# EAGLE design Design1 (EAGLE 9.5.1)
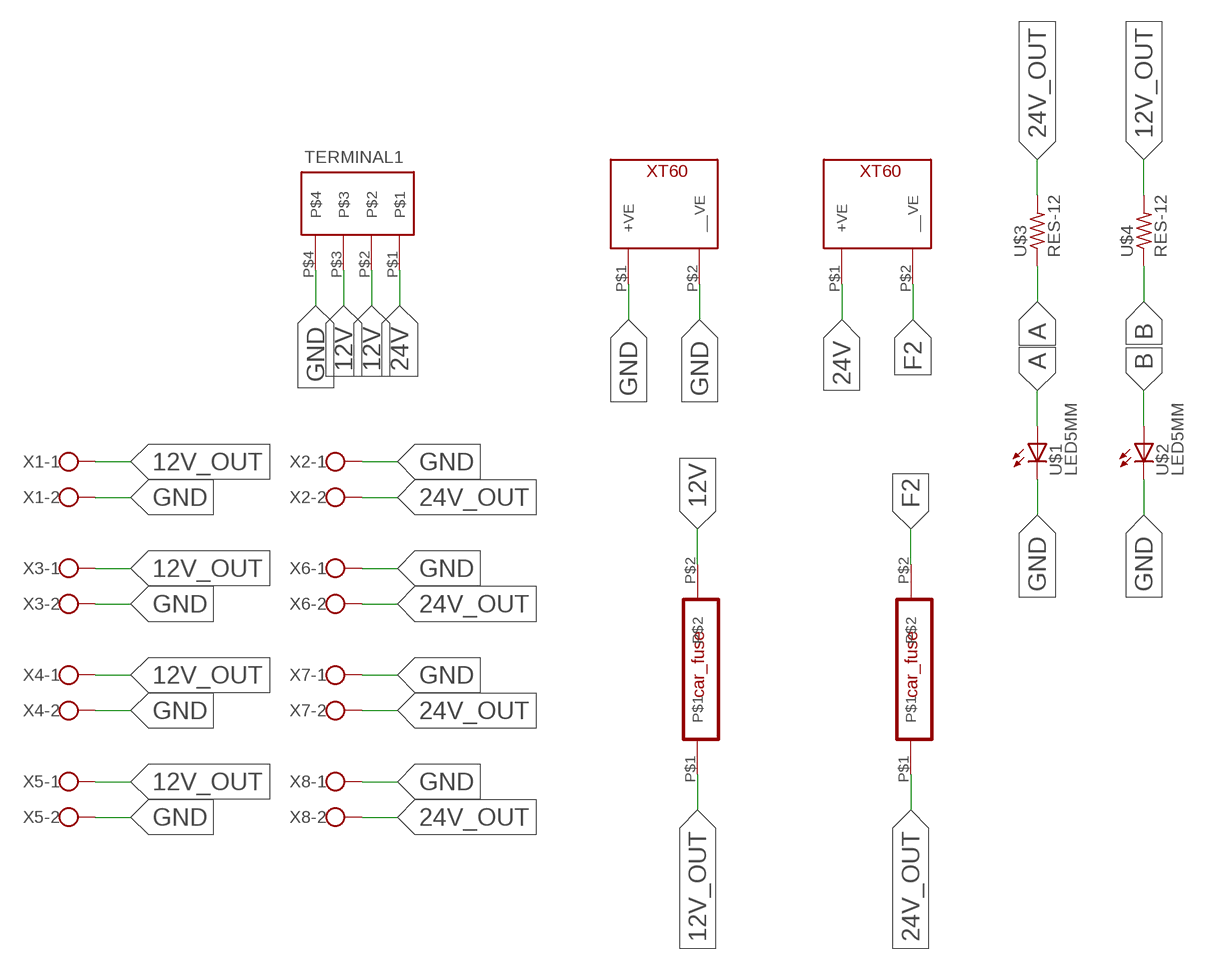
[diagram p0: schematic, sheet 1]

## Parts
FUSE_12  CAR_FUSE  [CAR_FUSE]
FUSE_24  CAR_FUSE  [CAR_FUSE]
SWITCH_12  XT60_CONNECTOR  [XT60]
SWITCH_24  XT60_CONNECTOR  [XT60]
TERMINAL1  BARRIER_TERMINAL_BLOCK_4PIN_9.5MM  [BARRIER_TERMINAL_BLOCK_4PIN_9.5MM]
U$1  LED5MM  [LED5MM]
U$2  LED5MM  [LED5MM]
U$3  RES-12  [0207/12]
U$4  RES-12  [0207/12]
X1  ROSTA.POWER  [W239-302]
X2  ROSTA.POWER  [W239-302]
X3  ROSTA.POWER  [W239-302]
X4  ROSTA.POWER  [W239-302]
X5  ROSTA.POWER  [W239-302]
X6  ROSTA.POWER  [W239-302]
X7  ROSTA.POWER  [W239-302]
X8  ROSTA.POWER  [W239-302]

## Nets
12V: FUSE_12.P$2 TERMINAL1.P$2 TERMINAL1.P$3
12V_OUT: FUSE_12.P$1 U$4.2 X1.1 X3.1 X4.1 X5.1
24V: SWITCH_24.P$1(+VE) TERMINAL1.P$1
24V_OUT: FUSE_24.P$1 U$3.2 X2.2 X6.2 X7.2 X8.2
A: U$1.A U$3.1
B: U$2.A U$4.1
F2: FUSE_24.P$2 SWITCH_24.P$2(__VE)
GND: SWITCH_12.P$1(+VE) SWITCH_12.P$2(__VE) TERMINAL1.P$4 U$1.K(C) U$2.K(C) X1.2 X2.1 X3.2 X4.2 X5.2 X6.1 X7.1 X8.1

## Library data of the parts
FUSE_12 FUSE_24 = MIA_LIBRARY-2-2-2:CAR_FUSE
SWITCH_12 SWITCH_24 = MIA_LIBRARY-2-2-2:XT60_CONNECTOR
TERMINAL1 = terminal_block_4pins:BARRIER_TERMINAL_BLOCK_4PIN_9.5MM
U$1 U$2 = MIA_LIBRARY-2-2-2:LED5MM
U$3 U$4 = MIA_LIBRARY-2-2-2:RES-12
X1-X8 = MIA_LIBRARY-2-2-2:ROSTA.POWER: WAGO SCREW CLAMP; OC_FARNELL: unknown; OC_NEWARK: unknown

## Board
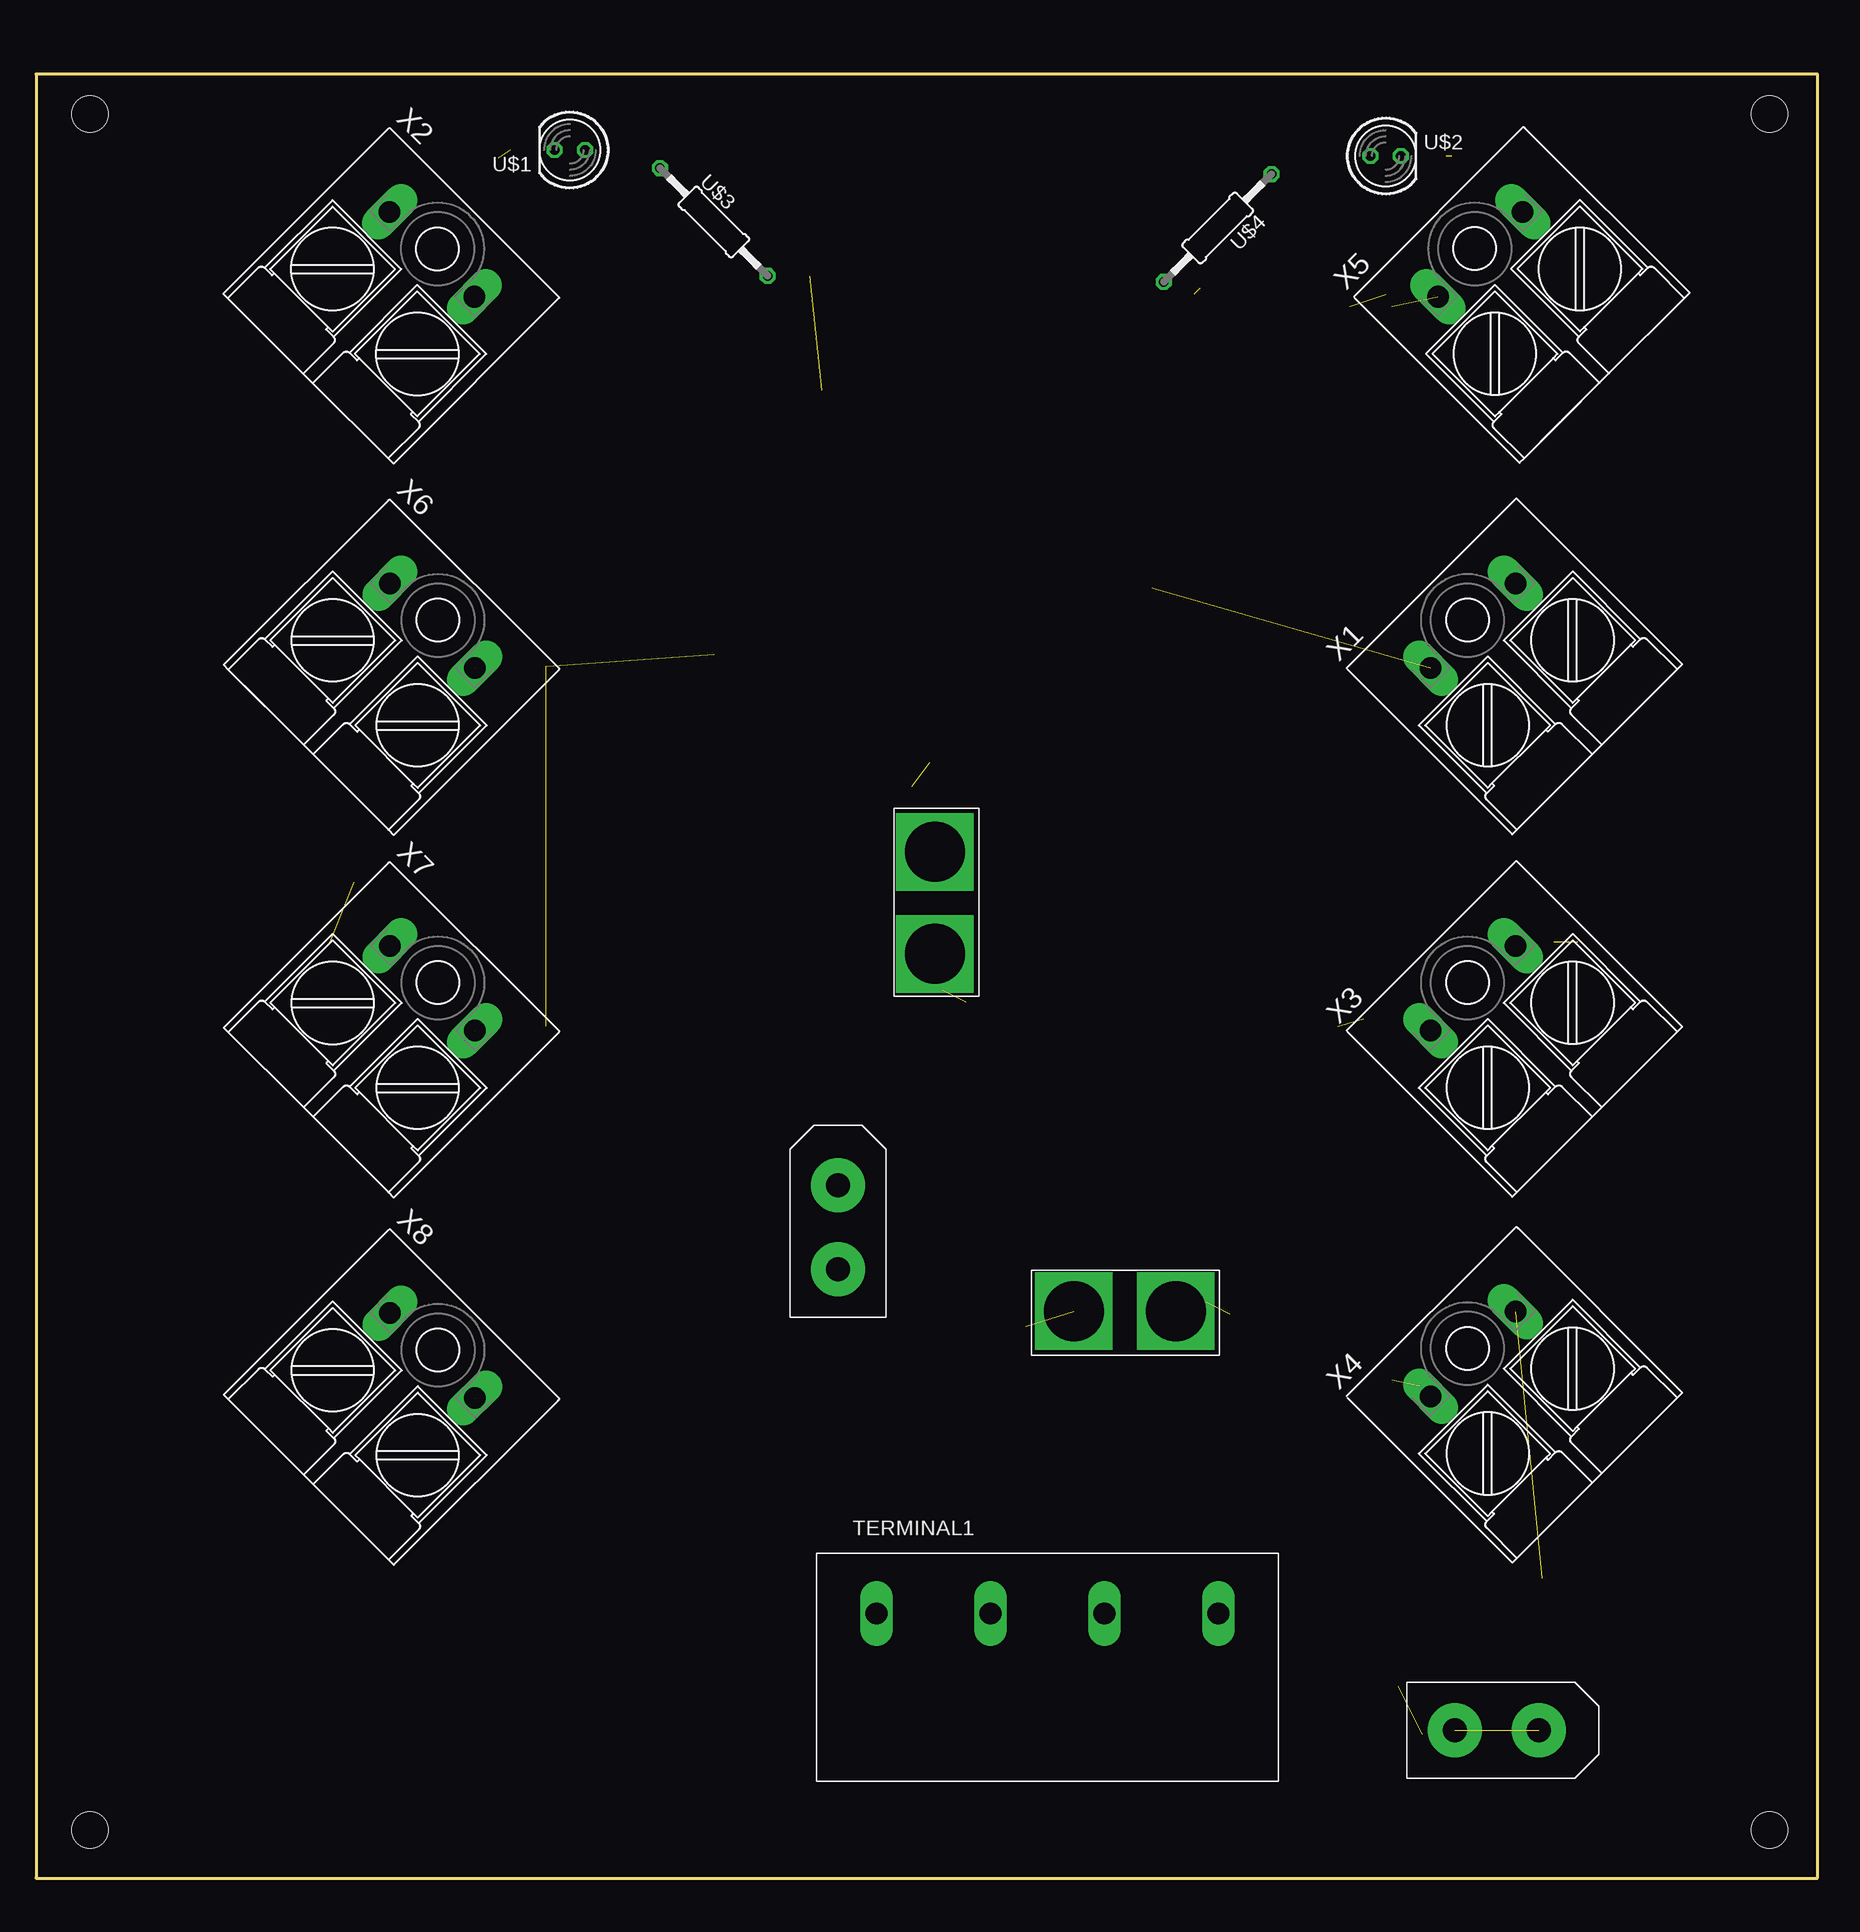
[diagram p1: board, top side]
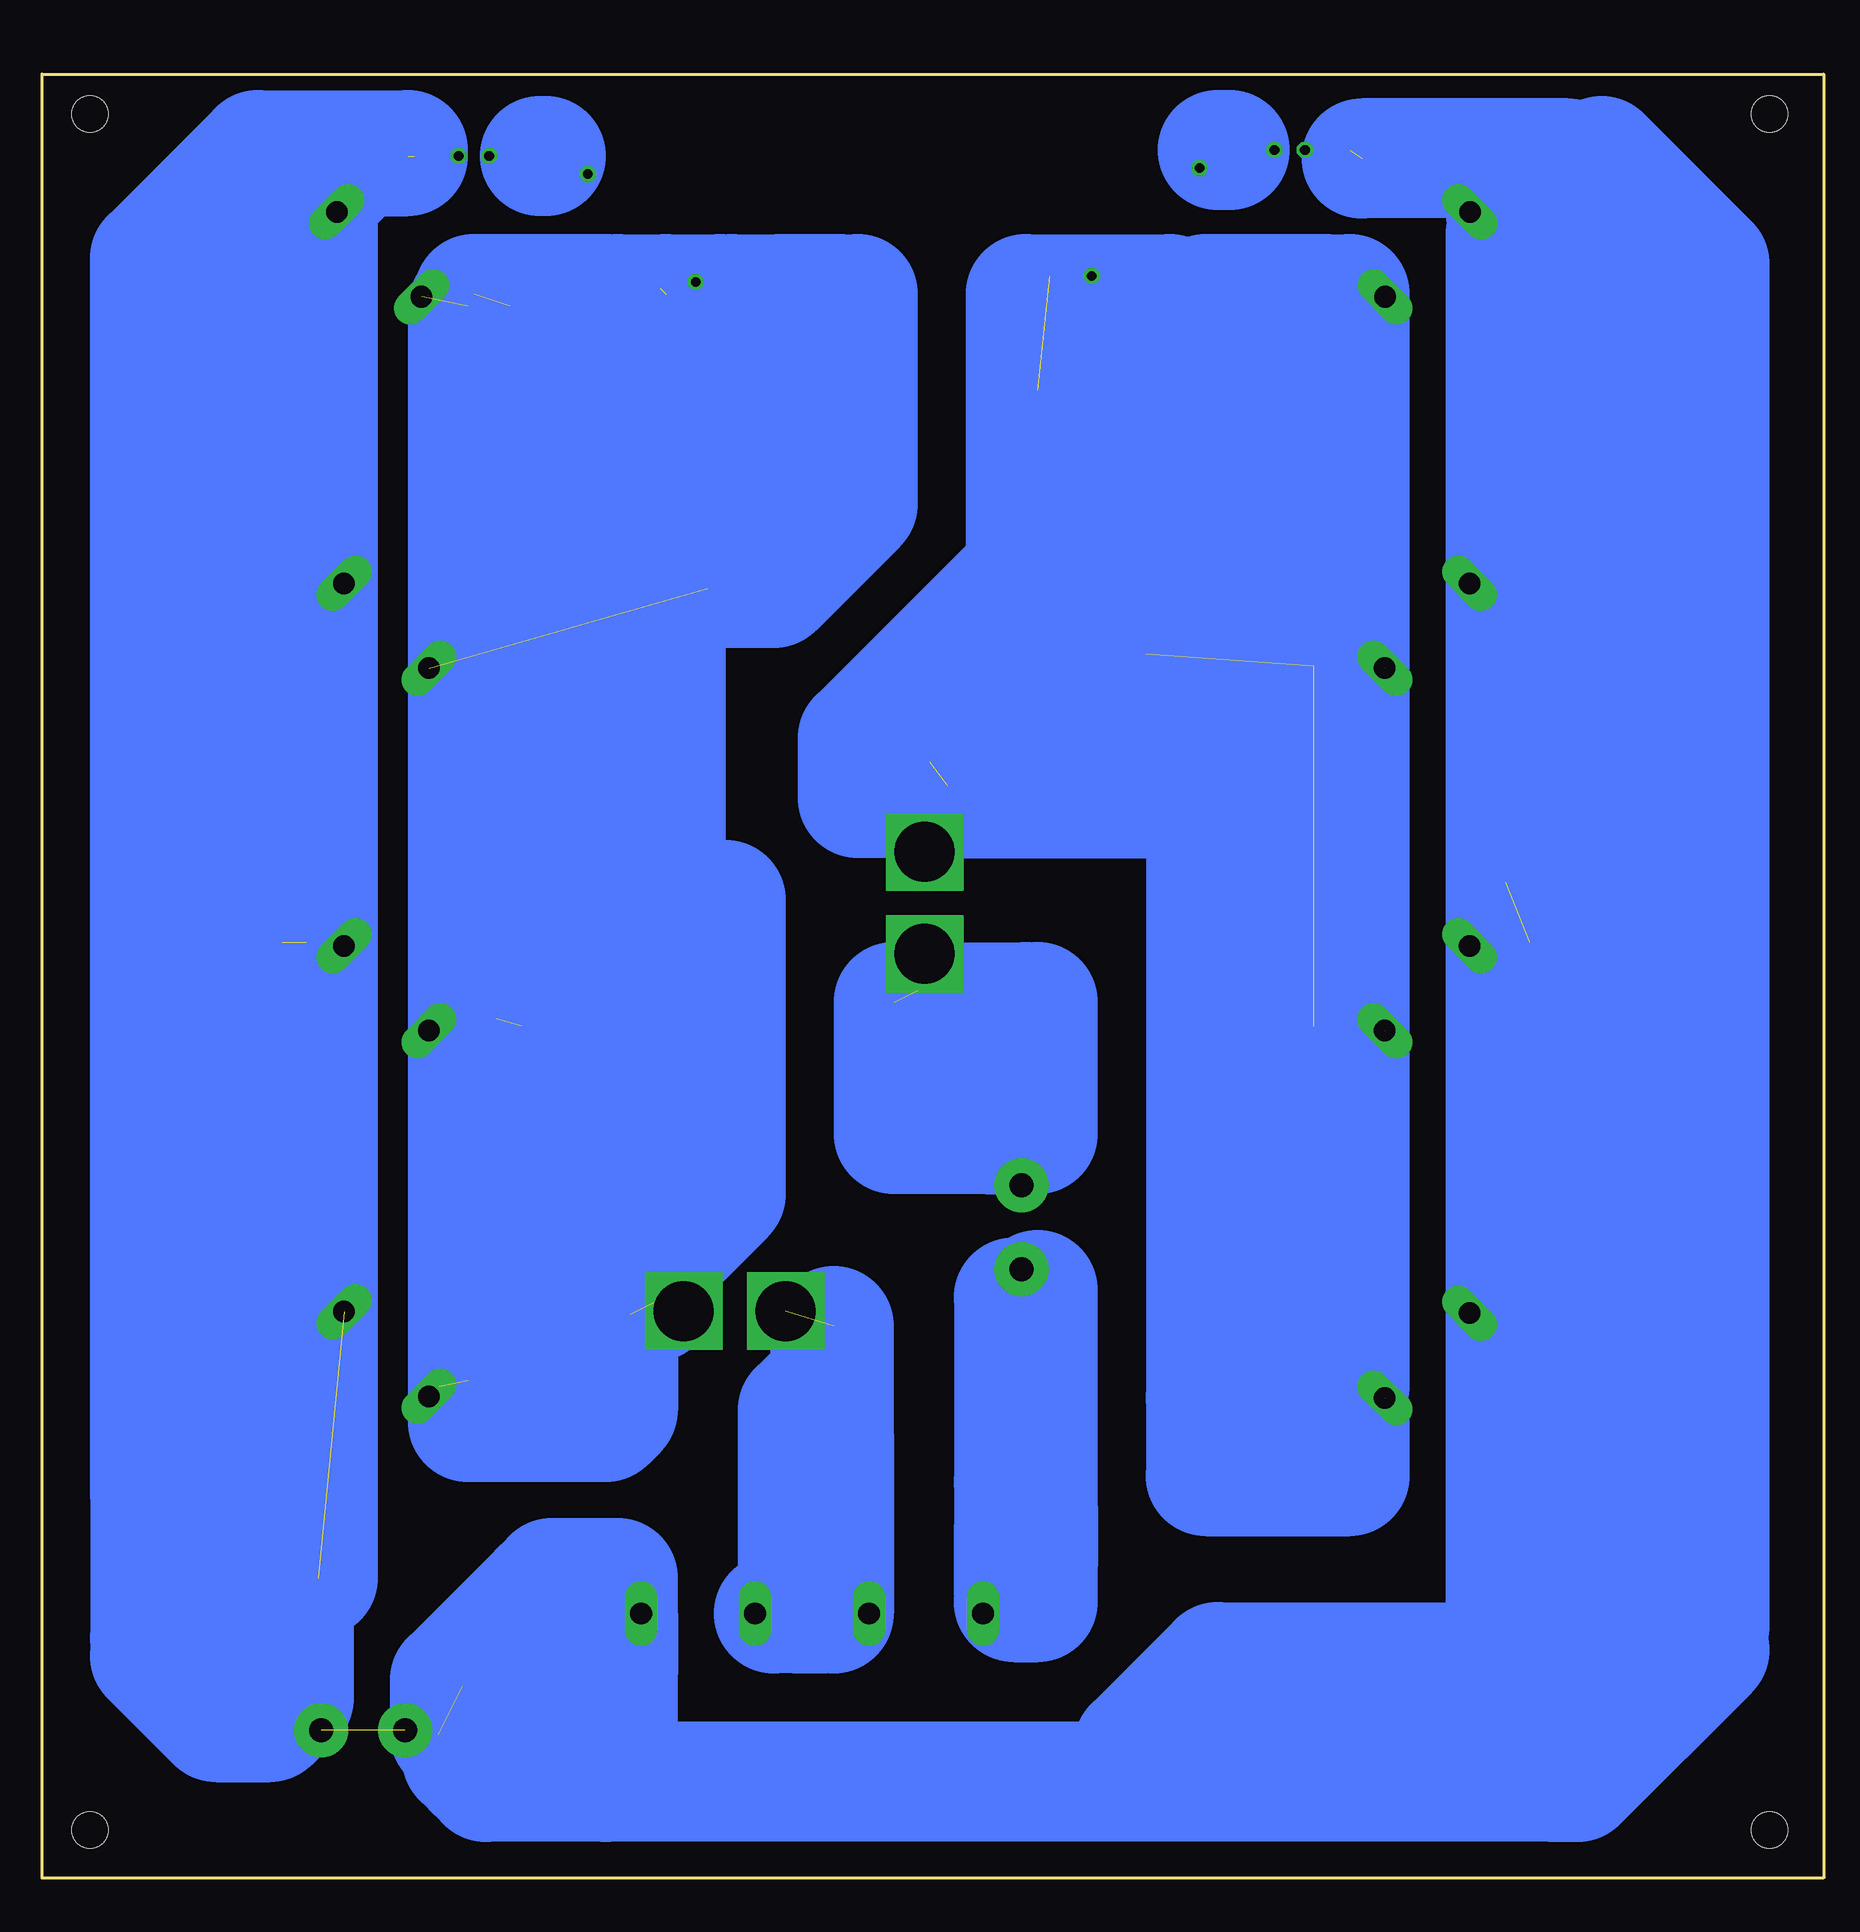
[diagram p2: board, bottom side, seen from below]

Size 148.5 x 150.32 mm. Coordinates in mm from the lower left corner, seen from the top.
Outline: 0,0 148.5,0 148.5,150.32 0,150.32 0,0
Copper layers (1*16): Top 0.035mm / dielectric 1.5mm / Bottom 0.035mm
Design rules "default": minimum track width 6mil, minimum drill 0.35mm, track to track 6mil, track to pad 6mil, pad to pad 6mil, via to via 6mil, smd to smd 6mil, copper to edge 40mil, drill to drill 6mil, minimum pad ring 10mil, minimum via ring 8mil, stop-mask expansion 4mil, vias tented up to drill 0mil, thermal gap 10mil
Holes 3 mm at 4.5,147 144.5,147 144.5,4 4.5,4

### Footprints (pad centres in the part's own frame; a part is rotated, then mirrored left to right if it is on the bottom)
CAR_FUSE = drill 5 pad 6.452 square: P$1 2.794,-0.127; P$2 11.303,-0.127
XT60 = drill 2 pad 4.5: P$1 -4,-4; P$2 -11,-4
BARRIER_TERMINAL_BLOCK_4PIN_9.5MM = drill 1.8 long: P$1 0,0; P$2 9.5,0; P$3 19,0; P$4 28.5,0
LED5MM = drill 0.813 octagon: A -1.27,0; K 1.27,0
0207/12 = drill 0.813 octagon: 1 -6.35,0; 2 6.35,0
W239-302 = drill 1.8 long: 1 -5,5; 2 5,5

### Placement (x,y rotation side)
FUSE_12  97.81,47.12 180 top
FUSE_24  75.06,88.31 270 top
SWITCH_12  114.25,8.31 180 top
SWITCH_24  70.87,46.75 270 top
TERMINAL1  70.06,22.05 0 top
U$1  44.5,144 180 top
U$2  112.5,143.5 0 top
U$3  56.5,138 315 top
U$4  98.5,137.5 225 top
X1  123.32,100.82 45 top
X2  29.47,131.77 315 top
X3  123.32,70.61 45 top
X4  123.32,40.13 45 top
X5  123.93,131.77 45 top
X6  29.5,100.82 315 top
X7  29.5,70.61 315 top
X8  29.5,40 315 top

### Tracks (layer width: path | path; a pad name or v marks a point on that pad's centre or on a via)
12V  (1 unrouted)
  Bottom 10: 85.5,22.05 83.5,22.05 | 85.5,22.05 85.5,37 | 85.5,37 82.5,37 | 82.5,37 82.5,22.05 | 82.5,37 82.5,46 | 85.5,37 85.5,39 83.5,41 | 85.5,22.05 87.5,22.05
  Bottom 2.54: TERMINAL1.P$2 82.5,22.05 83.5,22.05 | 87.5,22.05 TERMINAL1.P$3 | FUSE_12.P$2 86.51,36.01 86.5,36
12V_OUT  (7 unrouted)
  Bottom 0.152: U$4.2 95.99,133.01 96.5,132.5 97,132.5
  Bottom 10: 110.27,72 110.27,131.77 110.2,131.84 102.3,131.84 102.13,132 100.5,132 | 110.27,72 110.27,43.23 | 112.5,41 110.27,43.23 | 110.27,72 110.66,71.61 | 110.27,43.23 110.27,39.23 110.5,39 | 100.5,48 100.5,130.54 101.73,131.77 101.5,132 | 100.5,48 100.5,39 101.5,38 113,38 113,131 | 110.5,39 109.5,38 | 100.5,48 97.5,48 | 112.5,41 113,41.5 | 112.5,41 110.5,39 | 112.5,41 112.5,38 | 100.5,48 96.5,52 | 96.5,132 96.5,108 | 96.5,52 96.5,108 | 96.5,52 91.5,57 91.5,81.5 | 96.5,108 91,108 | 91,108 90.5,107.5 | 91,132 91,114 | 91,114 91,108 | 87,132 87,108 | 87,108 87.5,107.5 93,107.5 | 101.5,132 92,132 87,132 | 91,114 85,120 85,132 | 91,108 87,108 | 87,108 82,113 | 82,113 82,132 87,132 | 82,113 80.5,114.5 80.5,132 | 101.5,132 112.5,132
  Bottom 2.54: X4.1 115.38,41 | X3.1 114.5,70.61 113.5,71.61 109.11,71.61 108.5,71 | 110.27,131.77 109.5,131 | FUSE_12.P$1 99.25,47.25 99.5,47
24V
  Bottom 10: 65.5,31 65.5,26.61 65.5,26 67.5,24 67.5,29 65.5,31 | 65.5,31 67.5,33 | 67.5,48.38 67.5,33 | 67.5,33 67.5,23 65.5,23 65.5,49
  Bottom 2.54: TERMINAL1.P$1 65.5,26.61 65.5,27 | SWITCH_24.P$1 67.5,51.38 67.5,48.38 67.5,48
24V_OUT  (7 unrouted)
  Bottom 0.152: U$3.2 64.49,133.51 64.5,133.5
  Bottom 10: 42.5,40 42.5,132 39.5,132 39.5,41 40.5,40 | 41.5,132 51.5,132 51.5,100 | 51.5,100 51.5,40 | 42.5,40 51.5,40 | 42.5,101 39.5,101 | 42.5,71 39.5,71 | 42.5,40 40.5,40 | 74.93,90 62.93,102 56.5,102 | 58.5,110 65.5,110 | 74.93,90 80.5,90 80.5,95 65.5,110 | 65.5,110 66.5,111 66.5,132 54.5,132 54.5,115 58.5,111 61.5,111 61.5,122 | 61.5,122 62.5,122 | 61.5,122 61.5,125.5 59.5,127.5 59.75,127.75 61.75,127.75 65.5,124 | 51.5,40 51.5,33.5 39.5,33.5 39.5,39 40.5,40 | 51.5,100 60.5,91 73,91 | 74.93,90 53.5,90 53.5,114.5
  Bottom 2.54: X2.2 36.77,132 39.5,132 41.5,132 42.5,132 | X6.2 36.75,101 39.5,101 | X7.2 36.96,71 39.5,71 | 40.5,40 X8.2 | FUSE_24.P$1 74.93,90 74.93,92.57 74.5,93
A
  Bottom 0.152: U$3.1 50.5,144 | 50.5,144 | 50.5,144 49.5,144 U$1.A
  Bottom 10: 50.5,144 | 49.5,144 50.5,144
B
  Bottom 0.152: U$2.A 107,143.49 | 106.5,143.49 104.49,143.49 U$4.1
  Bottom 10: 106.5,143.49 107,143.49
F2  (1 unrouted)
  Bottom 10: 74.5,68.26 69.87,63.63 69.87,62 | 74.5,68.26 74.5,73 66.5,73 66.5,62.37 | 69.87,62 66.87,62 66.5,62.37 | 69.87,62 74.5,62 | 74.5,62 74.5,68.26 | 74.5,62 77.5,62 77.5,73 | 69.87,62 69.5,62.37 69.5,72 | 66.5,62.37 66.13,62 65.5,62 65.5,73
  Bottom 2.54: FUSE_24.P$2 74.93,74.57 75.5,74 | 66.87,62 SWITCH_24.P$2 | 69.87,63.63 69.5,64
GND  (7 unrouted)
  Bottom 0.152: U$1.K 39.5,144 | 117.5,143.5 U$2.K | 122,143.5 122,132.5
  Bottom 10: 131.5,32 139.5,32 | 139.5,32 139.5,20 | 22.48,8.02 9.5,21 9.5,124 | 24.66,138.84 19.5,133.68 19.5,78 | 18.5,20 19.5,21 | 19.5,78 19.5,21 | 9.5,124 18.5,133 | 26.5,47.07 24.57,47.07 | 19.5,78 26.5,78 26.5,83 | 23.61,107.89 26.5,107.89 | 24.66,138.84 26.5,138.84 25.5,137.84 25.5,115 | 131.5,32 131.5,78 | 131.5,78 131.5,108 | 131.5,108 131.5,123 | 131.5,123 131.5,136 | 131.5,136 127.5,140 125.5,140 | 139.5,32 139.5,127 | 139.5,127 132.5,134 | 139.5,127 139.5,128 | 139.5,128 131.5,136 | 129.3,47.2 126.5,47.2 | 131.5,78 126.5,78 | 131.5,108 131.39,107.89 126.5,107.89 | 19.5,21 23.5,17 | 29.5,11 23.5,17 | 23.5,17 24.5,18 | 57.5,11 50.5,18 24.5,18 | 102.45,22.05 104.45,22.05 111.5,15 111.5,9 | 101.5,8.02 111.5,8.02 | 22.48,8.02 101.5,8.02 | 101.5,8.02 100.5,9.02 100.5,17 | 100.5,17 105.5,17 105.5,13 | 100.5,17 100.5,22.05 100.5,24 | 112.5,9.02 111.5,8.02 | 112.5,9.02 112.5,17 107.5,22 106.5,22 | 111.5,8.02 111.5,9 | 111.5,9 114.5,12 114.5,16.5 107,24 | 132.5,13 139.5,20 | 132.5,13 129.5,13 127.5,15 127.5,124 | 131.5,14 131.5,32 | 112.5,9.02 113.5,10.02 113.5,16 | 26.5,47.07 26.5,107.89 | 131.5,123 127.5,127 127.5,139 | 125.5,25 125.5,140 | 24.66,138.84 29.12,143.3 | 29.12,143.3 38.5,143.3 | 125.5,140 122,143.5 | 125.5,140 125.5,141.5 123.5,143.5 | 123.5,143.5 118,143.5 | 24.5,18 26.5,20 26.5,47.07 | 100.5,24 107,24 | 100.5,24 100.5,25 106,25 107,24 | 26.5,107.89 26.5,137 24.66,138.84 | 139.5,128 139.5,130 | 139.5,130 126,143.5 123.5,143.5 | 139.5,130 139.5,131.5 | 139.5,131.5 127.5,143.5 | 139.5,131.5 139.5,135 130.5,144 118,144 | 9.5,124 9.5,127 | 9.5,127 24.5,142 | 9.5,127 9.5,131.5 | 9.5,131.5 21.3,143.3 29.12,143.3 | 9.5,131.5 9.5,134.5 18.5,143.5 | 22.48,8.02 20.48,8.02 9.5,19
  Bottom 10: 139.5,20 139.5,18.5 134,13 132.5,13
  Bottom 2.54: 26.5,47 29.43,47 X8.1 26.5,47.07 | X7.1 24.82,77.68 24.5,78 | 26.5,107.89 X6.1 | 23.5,108 23.61,107.89 | 24.5,47 24.57,47.07 | X2.1 26.5,138.84 | 24.66,138.84 24.5,139 | 126.5,47.2 X4.2 | 129.5,47 129.3,47.2 | 128.5,78 128.18,77.68 X3.2 129.18,77.68 129.5,78 | X1.2 126.5,107.89 128.39,107.89 128.5,108 | X5.2 124.09,139 127.5,139 129.5,139 | 98.5,19 98.56,19.06 TERMINAL1.P$4 100.5,22.05 102.45,22.05 102.5,22 | SWITCH_12.P$1 117.94,12 115.5,12 | SWITCH_12.P$2 126.19,12.31 126.5,12 131.5,12 132.5,13